# Altium project EDR_LIPO.PrjPcb
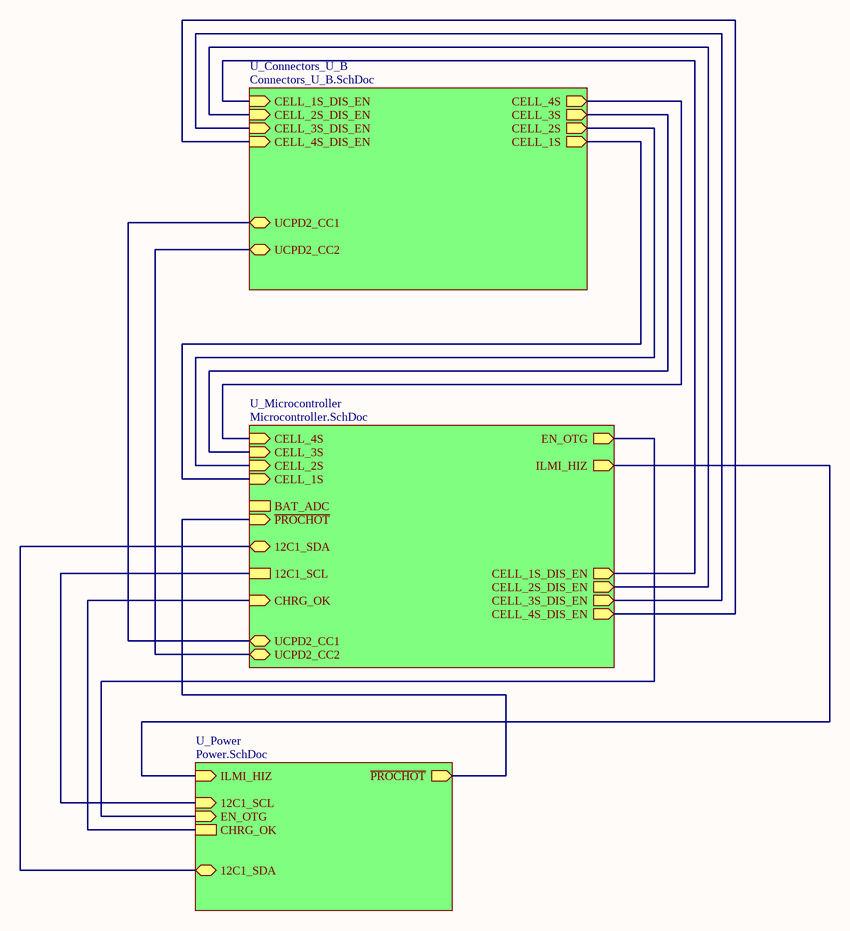
[diagram p0: Main.SchDoc]
4 sheets, 179 parts. Net scope: hierarchical (ports join the sheet entries above them; power ports are global).
Board file: Main_conection.PcbDoc
Sheets:
  Main.SchDoc
    U_Connectors_U_B = Connectors_U_B.SchDoc
    U_Microcontroller = Microcontroller.SchDoc
    U_Power = Power.SchDoc

## Sheet Main.SchDoc
size A; SheetNumber: 1; SheetTotal: 4

### Sub-sheets
U_Connectors_U_B = Connectors_U_B.SchDoc: CELL_4S (out), CELL_3S (out), CELL_2S (out), CELL_1S (out), CELL_1S_DIS_EN (in), CELL_2S_DIS_EN (in), CELL_3S_DIS_EN (in), CELL_4S_DIS_EN (in), UCPD2_CC1 (bidir), UCPD2_CC2 (bidir)
U_Microcontroller = Microcontroller.SchDoc: BAT_ADC, CELL_4S (in), CELL_3S (in), CELL_2S (in), CELL_1S (in), EN_OTG (out), ~{PROCHOT} (in), CELL_3S_DIS_EN (out), CELL_4S_DIS_EN (out), ILMI_HIZ (out), CELL_2S_DIS_EN (out), CELL_1S_DIS_EN (out), 12C1_SDA (bidir), 12C1_SCL, CHRG_OK (in), UCPD2_CC1 (bidir), UCPD2_CC2 (bidir)
U_Power = Power.SchDoc: ILMI_HIZ (in), ~{PROCHOT} (out), 12C1_SDA (bidir), 12C1_SCL (in), EN_OTG (in), CHRG_OK

### Nets
12C1_SCL: sheet U_Microcontroller/12C1_SCL, sheet U_Power/12C1_SCL
12C1_SDA: sheet U_Microcontroller/12C1_SDA, sheet U_Power/12C1_SDA
~{PROCHOT}: sheet U_Microcontroller/~{PROCHOT}, sheet U_Power/~{PROCHOT}
CELL_1S: sheet U_Connectors_U_B/CELL_1S, sheet U_Microcontroller/CELL_1S
CELL_1S_DIS_EN: sheet U_Connectors_U_B/CELL_1S_DIS_EN, sheet U_Microcontroller/CELL_1S_DIS_EN
CELL_2S: sheet U_Connectors_U_B/CELL_2S, sheet U_Microcontroller/CELL_2S
CELL_2S_DIS_EN: sheet U_Connectors_U_B/CELL_2S_DIS_EN, sheet U_Microcontroller/CELL_2S_DIS_EN
CELL_3S: sheet U_Connectors_U_B/CELL_3S, sheet U_Microcontroller/CELL_3S
CELL_3S_DIS_EN: sheet U_Connectors_U_B/CELL_3S_DIS_EN, sheet U_Microcontroller/CELL_3S_DIS_EN
CELL_4S: sheet U_Connectors_U_B/CELL_4S, sheet U_Microcontroller/CELL_4S
CELL_4S_DIS_EN: sheet U_Connectors_U_B/CELL_4S_DIS_EN, sheet U_Microcontroller/CELL_4S_DIS_EN
CHRG_OK: sheet U_Microcontroller/CHRG_OK, sheet U_Power/CHRG_OK
EN_OTG: sheet U_Microcontroller/EN_OTG, sheet U_Power/EN_OTG
ILIM_HIZ: sheet U_Microcontroller/ILMI_HIZ, sheet U_Power/ILMI_HIZ
UCPD2_CC1: sheet U_Connectors_U_B/UCPD2_CC1, sheet U_Microcontroller/UCPD2_CC1
UCPD2_CC2: sheet U_Connectors_U_B/UCPD2_CC2, sheet U_Microcontroller/UCPD2_CC2

## Sheet Connectors_U_B.SchDoc
size A4; SheetNumber: 2; SheetTotal: 4
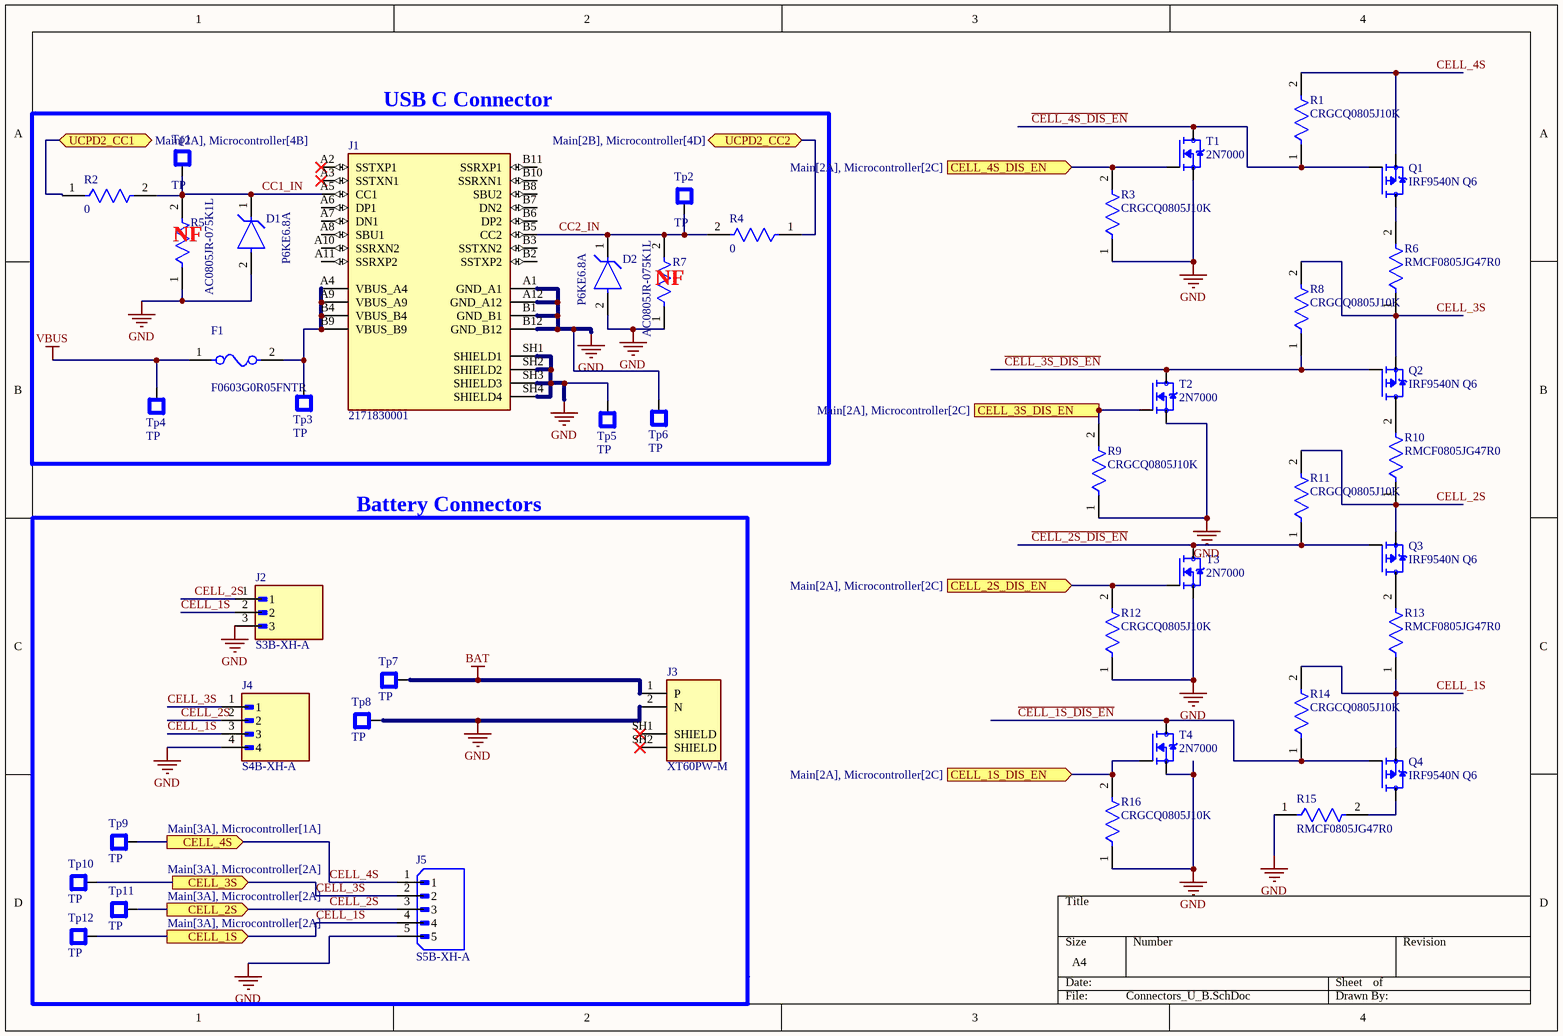
[diagram p1: Connectors_U_B.SchDoc]

### Parts
D1  P6KE6.8A  [FP-P6KE-MFG]
D2  P6KE6.8A  [FP-P6KE-MFG]
F1  F0603G0R05FNTR  [FP-F0603G-MFG]
J1  2171830001  [MOLEX_2171830001]
J2  S3B-XH-A  [JST_S3B-XH-A]
J3  XT60PW-M  [AMASS_XT60PW-M]
J4  S4B-XH-A  [JST_S4B-XH-A]
J5  S5B-XH-A  [JST_S5B-XH-A]
Q1  IRF9540N Q6  [TO254P1041X444X1930-3]
Q2  IRF9540N Q6  [TO254P1041X444X1930-3]
Q3  IRF9540N Q6  [TO254P1041X444X1930-3]
Q4  IRF9540N Q6  [TO254P1041X444X1930-3]
R1  CRGCQ0805J10K  [FP-CRGCQ0805-IPC_C]
R2  0  [FP-HCJ0805-MFG]
R3  CRGCQ0805J10K  [FP-CRGCQ0805-IPC_C]
R4  0  [FP-HCJ0805-MFG]
R5  AC0805JR-075K1L  [FP-AC0805-MFG]
R6  RMCF0805JG47R0  [FP-RMCF0805-MFG]
R7  AC0805JR-075K1L  [FP-AC0805-MFG]
R8  CRGCQ0805J10K  [FP-CRGCQ0805-IPC_C]
R9  CRGCQ0805J10K  [FP-CRGCQ0805-IPC_C]
R10  RMCF0805JG47R0  [FP-RMCF0805-MFG]
R11  CRGCQ0805J10K  [FP-CRGCQ0805-IPC_C]
R12  CRGCQ0805J10K  [FP-CRGCQ0805-IPC_C]
R13  RMCF0805JG47R0  [FP-RMCF0805-MFG]
R14  CRGCQ0805J10K  [FP-CRGCQ0805-IPC_C]
R15  RMCF0805JG47R0  [FP-RMCF0805-MFG]
R16  CRGCQ0805J10K  [FP-CRGCQ0805-IPC_C]
T1  2N7000  [TO92]
T2  2N7000  [TO92]
T3  2N7000  [TO92]
T4  2N7000  [TO92]
Tp1  TP  [Tp]
Tp2  TP  [Tp]
Tp3  TP  [Tp]
Tp4  TP  [Tp]
Tp5  TP  [Tp]
Tp6  TP  [Tp]
Tp7  TP  [Tp]
Tp8  TP  [Tp]
Tp9  TP  [Tp]
Tp10  TP  [Tp]
Tp11  TP  [Tp]
Tp12  TP  [Tp]

### Ports
CELL_1S (out, see Main[3A], Microcontroller[2A]), CELL_1S_DIS_EN (in, see Main[2A], Microcontroller[2C]), CELL_2S (out, see Main[3A], Microcontroller[2A]), CELL_2S_DIS_EN (in, see Main[2A], Microcontroller[2C]), CELL_3S (out, see Main[3A], Microcontroller[2A]), CELL_3S_DIS_EN (in, see Main[2A], Microcontroller[2C]), CELL_4S (out, see Main[3A], Microcontroller[1A]), CELL_4S_DIS_EN (in, see Main[2A], Microcontroller[2C]), UCPD2_CC1 (bidir, see Main[2A], Microcontroller[4B]), UCPD2_CC2 (bidir, see Main[2B], Microcontroller[4D])

### Nets
BAT: J3.1(P) Tp7.1
GND: D1.2(A) D2.2(A) J1.A1(GND_A1) J1.A12(GND_A12) J1.B1(GND_B1) J1.B12(GND_B12) J1.SH1(SHIELD1) J1.SH2(SHIELD2) J1.SH3(SHIELD3) J1.SH4(SHIELD4) J2.3 J3.2(N) J4.4 J5.5 R3.1 R5.1 R7.1 R9.1 R12.1 R15.1 R16.1 T1.1(S) T2.1(S) T3.1(S) T4.1(S) Tp5.1 Tp6.1 Tp8.1
VBUS: F1.1 Tp4.1
~{CELL_1S_DIS_EN}: Q4.1(G) R14.1 T4.3(D)
~{CELL_2S_DIS_EN}: Q3.1(G) R11.1 T3.3(D)
~{CELL_3S_DIS_EN}: Q2.1(G) R8.1 T2.3(D)
~{CELL_4S_DIS_EN}: Q1.1(G) R1.1 T1.3(D)
CC1_IN: D1.1(C) J1.A5(CC1) R2.2 R5.2 Tp1.1
CC2_IN: D2.1(C) J1.B5(CC2) R4.2 R7.2 Tp2.1
CELL_1S: J2.2 J4.3 J5.4 Q4.3(S) R13.1 R14.2 Tp12.1 ; port CELL_1S
CELL_1S_DIS_EN: R16.2 T4.2(G) ; port CELL_1S_DIS_EN
CELL_2S: J2.1 J4.2 J5.3 Q3.3(S) R10.1 R11.2 Tp11.1 ; port CELL_2S
CELL_2S_DIS_EN: R12.2 T3.2(G) ; port CELL_2S_DIS_EN
CELL_3S: J4.1 J5.2 Q2.3(S) R6.1 R8.2 Tp10.1 ; port CELL_3S
CELL_3S_DIS_EN: R9.2 T2.2(G) ; port CELL_3S_DIS_EN
CELL_4S: J5.1 Q1.3(S) R1.2 Tp9.1 ; port CELL_4S
CELL_4S_DIS_EN: R3.2 T1.2(G) ; port CELL_4S_DIS_EN
UCPD2_CC1: R2.1 ; port UCPD2_CC1
UCPD2_CC2: R4.1 ; port UCPD2_CC2
NetF1_2: F1.2 J1.A4(VBUS_A4) J1.A9(VBUS_A9) J1.B4(VBUS_B4) J1.B9(VBUS_B9) Tp3.1
NetQ1_2: Q1.2(D) R6.2
NetQ2_2: Q2.2(D) R10.2
NetQ3_2: Q3.2(D) R13.2
NetQ4_2: Q4.2(D) R15.2

Not connected (* = marked no-connect by the designer): J1 A2(SSTXP1)* A3(SSTXN1)* A6(DP1) A7(DN1) A8(SBU1) A10(SSRXN2) A11(SSRXP2) B2(SSTXP2) B3(SSTXN2) B6(DP2) B7(DN2) B8(SBU2) B10(SSRXN1) B11(SSRXP1); J3 SH1(SHIELD)* SH2(SHIELD)*

### Notes on the sheet
- USB C Connector
- (near R5) NF
- (near R7) NF
- Battery Connectors

### Library data of the parts
D1 D2 = CMP-08607-000072-1: TVS DIODE 5.8V 10.5V DO204AC; Manufacturer: Littelfuse Inc; Peak Pulse Power: 600W; Max Junction Temp: +175°C; Peak Pulse Current: 58.1A; Number Of Channels: 1; Direction: Unidirectional; Breakdown Voltage: 6.45V; Mouser Description: TVSS; Diode; For Data/Comm; Industrial Equip; 58.1A; Thru-Hole; Solder Term; Height: 3.6mm; RoHS: TRUE; Lead Free: Yes; Category: Diode; ComponentLink2Description: Datasheet; Manufacturer Part Number: P6KE6.8A; Package: P6KE; Temperature Range Low: -55°C; Device Class L3: unset; Digikey Description: TVS DIODE 5.8V 10.5V DO204AC; Temperature Range High: +175°C; Automotive: No; Clamping Voltage: 10.5V; Ipc Land Pattern Name: DIOPA1328W105L760D360; Octopart: https://octopart.com/p6ke6.8a-littelfuse-20808; ComponentLink2URL: https://www.littelfuse.com/~/media/electronics/datasheets/tvs_diodes/littelfuse_tvs_diode_p6ke_datasheet.pdf.pdf; Temperature: -55°C to +175°C; Device Class L2: TVS Diodes; Device Class L1: Circuit Protection; Reverse Standoff Voltage: 5.8V
F1 = CMP-04585-000004-1: FUSE BOARD MOUNT 50MA 32VDC 0603; Manufacturer: AVX Corporation; Voltage Rating: 32V; Fuse I2T: 0.000002A2Sec; Fuse Current: 0.125A; Fuse Voltage Drop: 250mV; Fuse Blow Speed: Fast; Value: 3.4Ω; ComponentLink2URL: http://datasheets.avx.com/AccuGuardLC_0603.pdf; Digikey Description: FUSE BOARD MOUNT 50MA 32VDC 0603; Lead Free: Yes; Temperature: -55°C to +125°C; Device Class L2: Fuses; Device Class L1: Circuit Protection; ComponentLink2Description: Datasheet; Category: Fuse; Package: F0603G; Height: 0.71mm; Mouser Description: Fuse Chip 0.05A 32V Fast 2-Pin Solder Pad Surface Mount T/R; Device Class L3: unset; Temperature Range High: +125°C; Temperature Range Low: -55°C; Octopart: https://octopart.com/f0603g0r05fntr-avx-21046321; Resistance: 3.4Ω; RoHS: TRUE; Manufacturer Part Number: F0603G0R05FNTR; Automotive: No
J1 = 2171830001: MF: {'manufacturer': u'Molex'}; Package: None; Price: None; Value: *; MP: 2171830001; Availability: Unavailable
J3 = XT60PW-M: Socket, DC supply, male, PIN: 2; MF: AMASS; SnapEDA_Link: https://www.snapeda.com/parts/XT60PW-M/AMASS/view-part/?ref=snap; Package: Package; Value: *; MP: XT60PW-M; Check_prices: https://www.snapeda.com/parts/XT60PW-M/AMASS/view-part/?ref=eda
J5 = S5B-XH-A: Connector Header Through Hole, Right Angle 5 position 0.098 (2.50mm); MF: JST Sales; SnapEDA_Link: https://www.snapeda.com/parts/S5B-XH-A/JST+Sales+America+Inc./view-part/?ref=snap; Package: None; Value: *; MP: S5B-XH-A; Check_prices: https://www.snapeda.com/parts/S5B-XH-A/JST+Sales+America+Inc./view-part/?ref=eda
Q1-Q4 = IRF9540N Q6: P-Channel 100 V 23A (Tc) 3.1W (Ta), 110W (Tc); MF: Infineon Technologies; Value: *; Purchase-URL: https://pricing.snapeda.com/search/part/IRF9540N/?ref=eda; Package: TO-220 Infineon; MP: IRF9540N; Check_prices: https://www.snapeda.com/parts/IRF9540N/Infineon+Technologies/view-part/?ref=eda; SnapEDA_Link: https://www.snapeda.com/parts/IRF9540N/Infineon+Technologies/view-part/?ref=snap; Price: None; Availability: In Stock
R1 R3 R8 R9 R11 R12 R14 R16 = CMP-03211-002989-1: CRGCQ 0805 10K 5%; Manufacturer: TE Connectivity; Voltage Rating: 150V; Temperature Coefficient: ±100ppm/°C; Resistance: 10KΩ; Value: 10KΩ; Power Rating: 0.125W; Tolerance: 0.05; Automotive Grade: Grade 914; Height: 0.65mm; Lead Free: Yes; Temperature Range High: +155°C; Composition: Thick Film; Temperature Range Low: -55°C; Ambient Temperature Range High: +70°C; Temperature: -55°C to +155°C; Package: CRGCQ0805; Device Class L2: Resistors; RoHS: TRUE; ComponentLink2URL: https://www.te.com/commerce/DocumentDelivery/DDEController?Action=showdoc&DocId=Data+Sheet%7F1773204-3%7F1%7Fpdf%7FEnglish%7FENG_DS_1773204-3_1.pdf%7F4-2176341-923; Manufacturer Part Number: CRGCQ0805J10K; Series: CRGCQ; Device Class L1: Passive Components; Ipc Land Pattern Name: RESC200125X55; ComponentLink2Description: Datasheet; Category: Res; Digikey Description: CRGCQ 0805 10K 5%; Mouser Description: Res Thick Film 0805 10K Ohm 5% 0.125W(1/8W) ±100ppm/C Pad SMD Automotive T/R; Automotive: Yes; Octopart: https://octopart.com/crgcq0805j10k-te+connectivity-91018201; Device Class L3: Chip SMD Resistors
R2 R4 = CMP-26527-000104-1: RES 0 OHM JUMPER 1/2W 0805; Resistance: 0mR; Radiation Hardening: No; Case Code (Imperial): 0805; Number of Terminations: 2; Lead Free: Lead Free; Max Operating Temperature: 155°C; Width: 0.049inch; Case Code (Metric): 2012; Height: 0.026inch; Mount: Surface Mount; Min Operating Temperature: -55°C; Packaging: Tape and Reel; Package Quantity: 1; Termination: Wraparound; Length: 0.079inch; RoHS Compliant: Yes; Case/Package: 0805
R5 R7 = CMP-2001-04477-2: RES SMD 5.1K OHM 5% 1/8W 0805; Manufacturer: Yageo; Automotive Grade: Grade 0; Value: 5.1KΩ; Voltage Rating: 150V; Tolerance: 0.05; Category: Res; RoHS: TRUE; Automotive: Yes; Device Class L1: Passive Components; Lead Free: Yes; Octopart: https://octopart.com/ac0805jr-075k1l-yageo-21711115; Series: AC; Temperature Range High: +155°C; ComponentLink2URL: http://www.yageo.com/documents/recent/PYu-AC_51_RoHS_L_6.pdf; Temperature Range Low: -55°C; ComponentLink2Description: Datasheet; Footprint Url: http://www.yageo.com/exep/pages/download/literatures/PYu-R_Mount_10.pdf; Mouser Description: Thick Film Resistors - SMD 5.1K ohm 5% 1/8W; Device Class L3: Chip SMD Resistors; Digikey Description: RES SMD 5.1K OHM 5% 1/8W 0805; Power Rating: 1/8W; Package: AC0805; Temperature: -55°C to +155°C; Device Class L2: Resistors; Resistance: 5.1KΩ; Height: 0.6mm; Manufacturer Part Number: AC0805JR-075K1L; Ipc Land Pattern Name: RESC200125X50; Composition: Thick Film
R6 R10 R13 R15 = CMP-26527-004456-1: 47Ω ±5% 0.125W 0805 Thick Film Chip Resistor AEC-Q200 compliant; Max Power Dissipation: 125mW; Resistance: 47R; Temperature Coefficient: 200ppm/°C; Packaging: Tape and Reel; Case Code (Metric): 2012; Mount: Surface Mount; Min Operating Temperature: -55°C; Package Quantity: 10000; Length: 0.079inch; Number of Terminations: 2; RoHS Compliant: Yes; Max Operating Temperature: 155°C; Case/Package: 0805; Height: 0.026inch; Radiation Hardening: No; Resistor Type: Thick Film; Contact Plating: Tin; Width: 0.049inch; Case Code (Imperial): 0805; Series: RMCF; Features: Automotive AEC-Q200; Tolerance: 5%
T1-T4 = 2N7000: N-Channel 60 V 200mA (Ta) 400mW (Ta) Through Hole TO-92-3; MF: onsemi; SnapEDA_Link: https://www.snapeda.com/parts/2N7000/Onsemi/view-part/?ref=snap; Package: E-PKG AXIAL-LEADED-2 ON Semiconductor; Value: *; MP: 2N7000; Check_prices: https://www.snapeda.com/parts/2N7000/Onsemi/view-part/?ref=eda
J2 = S3B-XH-A: Package: None; Price: None; Value: *; MP: S3B-XH-A; Availability: Unavailable
J4 = S4B-XH-A: Package: None; Price: None; Value: *; MP: S4B-XH-A; Availability: Unavailable

## Sheet Microcontroller.SchDoc
size A; SheetNumber: 4; SheetTotal: 4
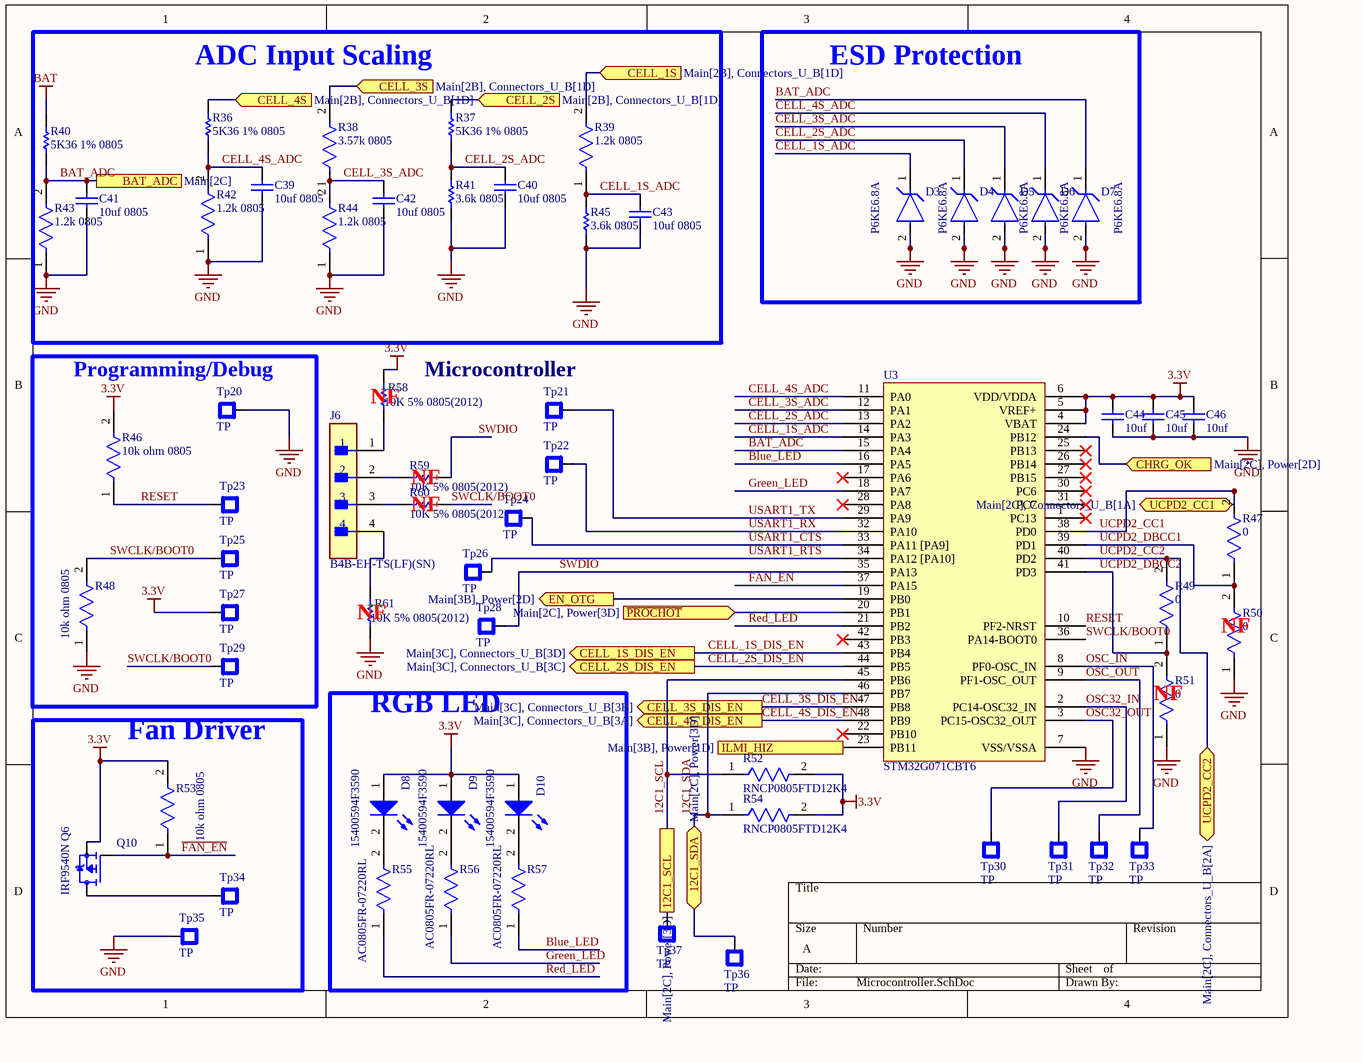
[diagram p2: Microcontroller.SchDoc]

### Parts
C39  10uf 0805  [CAPC2013X145X50NL20T20]
C40  10uf 0805  [CAPC2013X145X50NL20T20]
C41  10uf 0805  [CAPC2013X145X50NL20T20]
C42  10uf 0805  [CAPC2013X145X50NL20T20]
C43  10uf 0805  [CAPC2013X145X50NL20T20]
C44  10uf  [CAPC2013X145X50LL20T25]
C45  10uf  [CAPC2013X145X50LL20T25]
C46  10uf  [CAPC2013X145X50LL20T25]
D3  P6KE6.8A  [FP-P6KE-MFG]
D4  P6KE6.8A  [FP-P6KE-MFG]
D5  P6KE6.8A  [FP-P6KE-MFG]
D6  P6KE6.8A  [FP-P6KE-MFG]
D7  P6KE6.8A  [FP-P6KE-MFG]
D8  15400594F3590  [WL-TIRC_5mm]
D9  15400594F3590  [WL-TIRC_5mm]
D10  15400594F3590  [WL-TIRC_5mm]
J6  B4B-EH-TS(LF)(SN)  [FP-B4B-EH-TS_LF_SN-MFG]
Q10  IRF9540N Q6  [TO254P1041X444X1930-3]
R36  5K36 1% 0805  [RESC0805(2012)_M]
R37  5K36 1% 0805  [RESC0805(2012)_M]
R38  3.57k 0805  [FP-RT0805-MFG]
R39  1.2k 0805  [FP-RMCF0805-IPC_A]
R40  5K36 1% 0805  [RESC0805(2012)_M]
R41  3.6k 0805  [RESC0805(2012)_L]
R42  1.2k 0805  [FP-RMCF0805-IPC_A]
R43  1.2k 0805  [FP-RMCF0805-IPC_A]
R44  1.2k 0805  [FP-RMCF0805-IPC_A]
R45  3.6k 0805  [RESC0805(2012)_L]
R46  10k ohm 0805  [FP-MCU0805-IPC_C]
R47  0  [FP-HCJ0805-MFG]
R48  10k ohm 0805  [FP-MCU0805-IPC_C]
R49  0  [FP-HCJ0805-MFG]
R50  0  [FP-HCJ0805-MFG]
R51  0  [FP-HCJ0805-MFG]
R52  RNCP0805FTD12K4  [FP-RNCP0805-IPC_C]
R53  10k ohm 0805  [FP-MCU0805-IPC_C]
R54  RNCP0805FTD12K4  [FP-RNCP0805-IPC_C]
R55  AC0805FR-07220RL  [FP-AC0805-MFG]
R56  AC0805FR-07220RL  [FP-AC0805-MFG]
R57  AC0805FR-07220RL  [FP-AC0805-MFG]
R58  10K 5% 0805(2012)  [RESC0805(2012)_L]
R59  10K 5% 0805(2012)  [RESC0805(2012)_L]
R60  10K 5% 0805(2012)  [RESC0805(2012)_L]
R61  10K 5% 0805(2012)  [RESC0805(2012)_L]
Tp20  TP  [Tp]
Tp21  TP  [Tp]
Tp22  TP  [Tp]
Tp23  TP  [Tp]
Tp24  TP  [Tp]
Tp25  TP  [Tp]
Tp26  TP  [Tp]
Tp27  TP  [Tp]
Tp28  TP  [Tp]
Tp29  TP  [Tp]
Tp30  TP  [Tp]
Tp31  TP  [Tp]
Tp32  TP  [Tp]
Tp33  TP  [Tp]
Tp34  TP  [Tp]
Tp35  TP  [Tp]
Tp36  TP  [Tp]
Tp37  TP  [Tp]
U3  STM32G071CBT6  [QFP50P900X900X160-48N]

### Blocks framed on the sheet
ADC Input Scaling: C39-C43 R36-R45
ESD Protection: D3-D7
Programming/Debug: R46 R48 Tp20 Tp23 Tp25 Tp27 Tp29
Fan Driver: Q10 R53 Tp34 Tp35
RGB LED: D8-D10 R55-R57

### Ports
12C1_SCL (see Main[2C], Power[3D]), 12C1_SDA (bidir, see Main[2C], Power[3D]), BAT_ADC (see Main[2C]), CELL_1S (in, see Main[2B], Connectors_U_B[1D]), CELL_1S_DIS_EN (out, see Main[3C], Connectors_U_B[3D]), CELL_2S (in, see Main[2B], Connectors_U_B[1D]), CELL_2S_DIS_EN (out, see Main[3C], Connectors_U_B[3C]), CELL_3S (in, see Main[2B], Connectors_U_B[1D]), CELL_3S_DIS_EN (out, see Main[3C], Connectors_U_B[3B]), CELL_4S (in, see Main[2B], Connectors_U_B[1D]), CELL_4S_DIS_EN (out, see Main[3C], Connectors_U_B[3A]), CHRG_OK (in, see Main[2C], Power[2D]), EN_OTG (out, see Main[3B], Power[2D]), ILMI_HIZ (out, see Main[3B], Power[1D]), UCPD2_CC1 (bidir, see Main[2C], Connectors_U_B[1A]), UCPD2_CC2 (bidir, see Main[2C], Connectors_U_B[2A]), ~{PROCHOT} (in, see Main[2C], Power[3D])

### Nets
3.3V: C44.2 C45.2 C46.2 D8.1(A) D9.1(A) D10.1(A) Q10.3(S) R46.2 R52.2 R53.2 R54.2 R58.2 Tp27.1 U3.4(VBAT) U3.5(VREF+) U3.6(VDD/VDDA)
BAT: R40.2
GND: C39.1 C40.1 C41.1 C42.1 C43.1 C44.1 C45.1 C46.1 D3.2(A) D4.2(A) D5.2(A) D6.2(A) D7.2(A) R41.1 R42.1 R43.1 R44.1 R45.1 R48.1 R50.1 R51.1 R61.1 Tp20.1 Tp35.1 U3.7(VSS/VSSA)
12C1_SCL: R52.1 Tp37.1 U3.45(PB6) ; port 12C1_SCL
12C1_SDA: R54.1 Tp36.1 U3.46(PB7) ; port 12C1_SDA
~{PROCHOT}: U3.20(PB1) ; port ~{PROCHOT}
BAT_ADC: C41.2 D7.1(C) R40.1 R43.2 U3.15(PA4) ; port BAT_ADC
Blue_LED: R57.1 U3.16(PA5)
CELL_1S: R39.2 ; port CELL_1S
CELL_1S_ADC: C43.2 D3.1(C) R39.1 R45.2 U3.14(PA3)
CELL_1S_DIS_EN: U3.43(PB4) ; port CELL_1S_DIS_EN
CELL_2S: R37.2 ; port CELL_2S
CELL_2S_ADC: C40.2 D4.1(C) R37.1 R41.2 U3.13(PA2)
CELL_2S_DIS_EN: U3.44(PB5) ; port CELL_2S_DIS_EN
CELL_3S: R38.2 ; port CELL_3S
CELL_3S_ADC: C42.2 D5.1(C) R38.1 R44.2 U3.12(PA1)
CELL_3S_DIS_EN: U3.47(PB8) ; port CELL_3S_DIS_EN
CELL_4S: R36.2 ; port CELL_4S
CELL_4S_ADC: C39.2 D6.1(C) R36.1 R42.2 U3.11(PA0)
CELL_4S_DIS_EN: U3.48(PB9) ; port CELL_4S_DIS_EN
CHRG_OK: U3.24(PB12) ; port CHRG_OK
EN_OTG: U3.19(PB0) ; port EN_OTG
~{FAN_EN}: Q10.1(G) R53.1 U3.37(PA15)
Green_LED: R56.1 U3.18(PA7)
ILIM_HIZ: U3.23(PB11) ; port ILMI_HIZ
OSC32_IN: Tp31.1 U3.2(PC14-OSC32_IN)
OSC32_OUT: Tp30.1 U3.3(PC15-OSC32_OUT)
OSC_IN: Tp33.1 U3.8(PF0-OSC_IN)
OSC_OUT: Tp32.1 U3.9(PF1-OSC_OUT)
Red_LED: R55.1 U3.21(PB2)
RESET: R46.1 Tp23.1 U3.10(PF2-NRST)
SWCLK/BOOT0: R48.2 R60.2 Tp25.1 Tp29.1 U3.36(PA14-BOOT0)
SWDIO: R59.2 Tp28.1 U3.35(PA13)
UCPD2_CC1: R47.2 U3.38(PD0) ; port UCPD2_CC1
UCPD2_CC2: R49.2 U3.40(PD2) ; port UCPD2_CC2
UCPD2_DBCC1: R47.1 R50.2 U3.39(PD1)
UCPD2_DBCC2: R49.1 R51.2 U3.41(PD3)
USART1_CTS: Tp24.1 U3.33(PA11_[PA9])
USART1_RTS: Tp26.1 U3.34(PA12_[PA10])
USART1_RX: Tp22.1 U3.32(PA10)
USART1_TX: Tp21.1 U3.29(PA9)
NetD8_2: D8.2(K) R55.2
NetD9_2: D9.2(K) R56.2
NetD10_2: D10.2(K) R57.2
NetJ6_1: J6.1 R58.1
NetJ6_2: J6.2 R59.1
NetJ6_3: J6.3 R60.1
NetJ6_4: J6.4 R61.2
NetQ10_2: Q10.2(D) Tp34.1

Not connected (* = marked no-connect by the designer): U3 1(PC13)* 17(PA6)* 22(PB10)* 25(PB13)* 26(PB14)* 27(PB15)* 28(PA8)* 30(PC6)* 31(PC7)* 42(PB3)*

### Notes on the sheet
- (near R58) NF
- Microcontroller
- (near R59) NF
- (near R60) NF
- (near R61) NF
- (near R50) NF
- (near R51) NF

### Library data of the parts
C39-C43 = CMP-2007-01676-1: Part Number: VJ0805Y105KXQRW1BC; Manufacturer: Vitramon
C44-C46 = CMP-2007-01044-1: Manufacturer: Kemet; Part Number: C0805C106K8RACTU
D3-D7 = CMP-08607-000072-1: as D1 on sheet Connectors_U_B; Mouser Description: TVSS; Diode; For Data/Comm; Industrial Equip; 58.1A; Thru-Hole; Solder Term; Height: 3.6mm; RoHS: TRUE; Lead Free: Yes; Category: Diode; ComponentLink2Description: Datasheet; Manufacturer Part Number: P6KE6.8A; Package: P6KE; Temperature Range Low: -55°C; Device Class L3: unset; Digikey Description: TVS DIODE 5.8V 10.5V DO204AC; Temperature Range High: +175°C; Automotive: No; Clamping Voltage: 10.5V; Ipc Land Pattern Name: DIOPA1328W105L760D360; Octopart: https://octopart.com/p6ke6.8a-littelfuse-20808; ComponentLink2URL: https://www.littelfuse.com/~/media/electronics/datasheets/tvs_diodes/littelfuse_tvs_diode_p6ke_datasheet.pdf.pdf; Temperature: -55°C to +175°C; Device Class L2: TVS Diodes; Device Class L1: Circuit Protection; Reverse Standoff Voltage: 5.8V
D8-D10 = CMP-03913-110288041-2: Led, 5Mm, 940Nm, 30Mw/Sr, Th Rohs Compliant: Yes; Forward Voltage: 1.3V; Viewing Angle: 30°; Forward Current: 1A; Max Reverse Voltage (DC): 5V; RoHS: Compliant; Peak Wavelength: 940nm; Max Operating Temperature: 85°C; Min Operating Temperature: -40°C
J6 = CMP-17439-000699-1: CONN HEADER EH TOP 4POS 2.5MM; Number of Positions: 4; Case/Package: Radial; Pitch: 2.5mm; Lead Free: Lead Free; Termination: Crimp
Q10 = IRF9540N Q6: as Q1 on sheet Connectors_U_B; Value: *; Purchase-URL: https://pricing.snapeda.com/search/part/IRF9540N/?ref=eda; Package: TO-220 Infineon; MP: IRF9540N; Check_prices: https://www.snapeda.com/parts/IRF9540N/Infineon+Technologies/view-part/?ref=eda; SnapEDA_Link: https://www.snapeda.com/parts/IRF9540N/Infineon+Technologies/view-part/?ref=snap; Price: None; Availability: In Stock
R36 R37 R40 = CMP-1013-00593-1: 5K36 0.125W 1% 0805 (2012 Metric)  SMD; Value: 5360.00 Ohm; Case-Metric: 2012; Case-EIA: 0805; Power: 0.125 W; Tolerance: 1 %; Technology: SMT
R38 = CMP-03412-012413-1: RES 357K OHM 1/8W .1% SMD 0805; Manufacturer: Yageo; Manufacturer Part Number: RT0805BRD07357KL; Temperature Coefficient: 25 ppm/°C; Voltage Rating: 150V; Value: 357KΩ; Power Rating: 0.125W; Tolerance: 0.0025; Automotive: No; Octopart: https://octopart.com/rt0805brd07357kl-yageo-1483813; Package: RT0805; Ipc Land Pattern Name: RESC200125X50; ComponentLink2Description: Datasheet; Series: RT; ComponentLink2URL: http://www.yageo.com/documents/recent/PYu-RT_1-to-0.01_RoHS_L_9.pdf; Device Class L1: Passive Components; Height: 0.6mm; Digikey Description: RES 357K OHM 1/8W .1% SMD 0805; Category: Res; Lead Free: Yes; Temperature: -55°C to +155°C; Composition: Thin Film; Mouser Description: Thin Film Resistors - SMD 1/8W 357K ohm .1% 25ppm; Device Class L2: Resistors; RoHS: TRUE; Temperature Range High: +155°C; Device Class L3: Chip SMD Resistors; Resistance: 357KΩ; Footprint Url: http://www.yageo.com/exep/pages/download/literatures/PYu-R_Mount_10.pdf; Temperature Range Low: -55°C
R39 R42-R44 = CMP-26527-005543-1: 1.2kΩ ±5% 0.125W 0805 Thick Film Chip Resistor AEC-Q200 compliant; Resistance: 1.2kR; Temperature Coefficient: 200ppm/°C; Max Power Dissipation: 125mW; RoHS Compliant: Yes; Width: 0.049inch; Max Operating Temperature: 155°C; Features: Automotive AEC-Q200; Contact Plating: Tin; Series: RMCF; Height: 0.026inch; Radiation Hardening: No; Packaging: Tape and Reel; Number of Terminations: 2; Length: 0.079inch; Min Operating Temperature: -55°C; Resistor Type: Thick Film; Case/Package: 0805; Tolerance: 5%; Mount: Surface Mount
R41 R45 = CMP-1013-00087-1: 3K6 0.125W 5% 0805 (2012 Metric)  SMD; Case-Metric: 2012; Value: 3600.00 Ohm; Case-EIA: 0805; Technology: SMT; Tolerance: 5 %; Power: 0.125 W
R46 R48 R53 = CMP-02407-000241-1: RES 1.05K OHM 0.5% 1/5W 0805; Power Rating: 200mW; Tolerance: 0.1%; Voltage Rating: 150V; Resistance: 10kR; Height: 0.52mm; Min Operating Temperature: -55°C; Packaging: Tape and Reel; Case Code (Imperial): 0805; Case/Package: 0805; Case Code (Metric): 2012; Weight: 0.000162oz; Width: 1.25mm; Length: 2mm; Max Operating Temperature: 155°C; Composition: Thin Film
R47 R49-R51 = CMP-26527-000104-1: as R2 on sheet Connectors_U_B; Radiation Hardening: No; Case Code (Imperial): 0805; Number of Terminations: 2; Lead Free: Lead Free; Max Operating Temperature: 155°C; Width: 0.049inch; Case Code (Metric): 2012; Height: 0.026inch; Mount: Surface Mount; Min Operating Temperature: -55°C; Packaging: Tape and Reel; Package Quantity: 1; Termination: Wraparound; Length: 0.079inch; RoHS Compliant: Yes; Case/Package: 0805
R52 R54 = CMP-26527-001038-1: 12.4kΩ ±1% 0.25W 0805 High Power Anti-Sulfur Thin Film Chip Resistor; Temperature Coefficient: 100ppm/°C; Max Power Dissipation: 250mW; Resistance: 12.4kR; Height: 0.024inch; Resistor Type: Thin Film; Width: 0.049inch; Case/Package: 0805; Series: RNCP; Min Operating Temperature: -55°C; Case Code (Metric): 2012; Packaging: Tape and Reel; Case Code (Imperial): 0805; Tolerance: 1%; RoHS Compliant: Yes; Max Operating Temperature: 155°C; Number of Terminations: 2; Features: Moisture Resistant; Length: 0.079inch; Mount: Surface Mount
R55-R57 = CMP-2001-04488-2: RES SMD 220 OHM 1% 1/8W 0805; Manufacturer: Yageo; Value: 220Ω; Tolerance: 0.01; Voltage Rating: 150V; Automotive Grade: Grade 0; Automotive: Yes; Composition: Thick Film; Lead Free: Yes; Octopart: https://octopart.com/ac0805fr-07220rl-yageo-26041145; Series: AC; Device Class L1: Passive Components; Temperature: -55°C to +155°C; Device Class L3: Chip SMD Resistors; Package: AC0805; Digikey Description: RES SMD 220 OHM 1% 1/8W 0805; ComponentLink2URL: http://www.yageo.com/documents/recent/PYu-AC_51_RoHS_L_6.pdf; ComponentLink2Description: Datasheet; Resistance: 220Ω; Mouser Description: Thick Film Resistors - SMD 1/8W 220ohm 1% AEC-Q200; Ipc Land Pattern Name: RESC200125X50; Power Rating: 1/8W; Device Class L2: Resistors; Category: Res; Footprint Url: http://www.yageo.com/exep/pages/download/literatures/PYu-R_Mount_10.pdf; Manufacturer Part Number: AC0805FR-07220RL; Temperature Range Low: -55°C; Height: 0.6mm; Temperature Range High: +155°C; RoHS: TRUE
R58-R61 = CMP-1013-00098-1: 10K 0.125W 5% 0805 (2012 Metric)  SMD; Case-EIA: 0805; Case-Metric: 2012; Value: 10000.00 Ohm; Power: 0.125 W; Technology: SMT; Tolerance: 5 %
U3 = STM32G071CBT6: MCU 32-bit ARM Cortex M0+ RISC 128KB Flash 1.8V/2.5V/3.3V 48-Pin LQFP Tray; Manufacturer: STMicroelectronics; ADC Channels (Resolution): 14-Ch 12-Bit; Core Architecture: ARM Cortex-M0+; DAC Channels (Resolution): 2-Ch 12-Bit; Data Bus Width: 32b; EEPROM Memory Size: 0B; Frequency: 64MHz; Interface: I2S; Clock Frequency: 48MHz; Max Junction Temperature (Tj): 105°C; Max Supply Current: 7mA; Max Supply Voltage: 3.6V; Min Supply Voltage: 1.7V; Number of A/D Converters: 1; Number of ADC Channels: 17; Number of Channels: 14; Number of D/A Converters: 2; Number of I/Os: 5; Number of Interrupts: 44; Number of Timers/Counters: 12; Number of UART Channels: 0; Number of USART Channels: 4; Operating Supply Voltage: 1.8V; Peripherals: POR, PWM, WDT; RAM Size: 36kB; Supplier: Avnet; Supplier Part Number: 84AC2899; Manufacturer Part Number: STM32G071CBT6; RoHS: Compliant; Category: Microcontrollers; Stock: 1757; Pricing: 1=3.97, 10=3.29, 25=3.08, 50=2.97, 100=2.86, 250=2.76, 500=2.69 (USD); Ambient Temperature Range High: 85°C; Case/Package: LFQFP; China RoHS: Compliant; Country of Origin: Mainland China; Export Control Classification Number (ECCN) Code: 3A991.A.2; Flash Memory Size: 128kB; Height: 1.6mm; Height - Seated (Max): 1.6mm; Harmonized Tariff Schedule (HTS) Code: 8542.31.00.25; Introduction Date: 2019-03-07; Length: 7mm; Lifecycle Status: Production; Max Operating Temperature: 85°C; Memory Size: 128kB; Memory Format: FLASH; Min Operating Temperature: -40°C; Number of I2C Channels: 2; Number of SPI Channels: 2; Number of Terminals: 48; Number of USB Channels: 2; REACH SVHC: Yes; Schedule B: 8542310000, 8542310000|8542310000, 8542310000|8542310000|8542310000|8542310000|8542310000; Terminal Pitch: 500µm; Width: 7mm; ComponentLink1URL: https://datasheet.octopart.com:443/STM32G071CBT6-STMicroelectronics-datasheet-159144893.pdf?src-supplier=IHS; ComponentLink1Description: https://datasheet.octopart.com:443/STM32G071CBT6-STMicroelectronics-datasheet-159144893.pdf?src-supplier=IHS; ComponentLink2URL: https://datasheet.octopart.com:443/STM32G071CBT6-STMicroelectronics-datasheet-132344621.pdf?src-supplier=ODG+(Origin+Data+Global); ComponentLink2Description: https://datasheet.octopart.com:443/STM32G071CBT6-STMicroelectronics-datasheet-132344621.pdf?src-supplier=ODG+(Origin+Data+Global); ComponentLink3URL: https://datasheet.octopart.com:443/STM32G071CBT6-STMicroelectronics-datasheet-130125765.pdf?src-supplier=element14+APAC; ComponentLink3Description: https://datasheet.octopart.com:443/STM32G071CBT6-STMicroelectronics-datasheet-130125765.pdf?src-supplier=element14+APAC

## Sheet Power.SchDoc
size A3; SheetNumber: 3; SheetTotal: 4
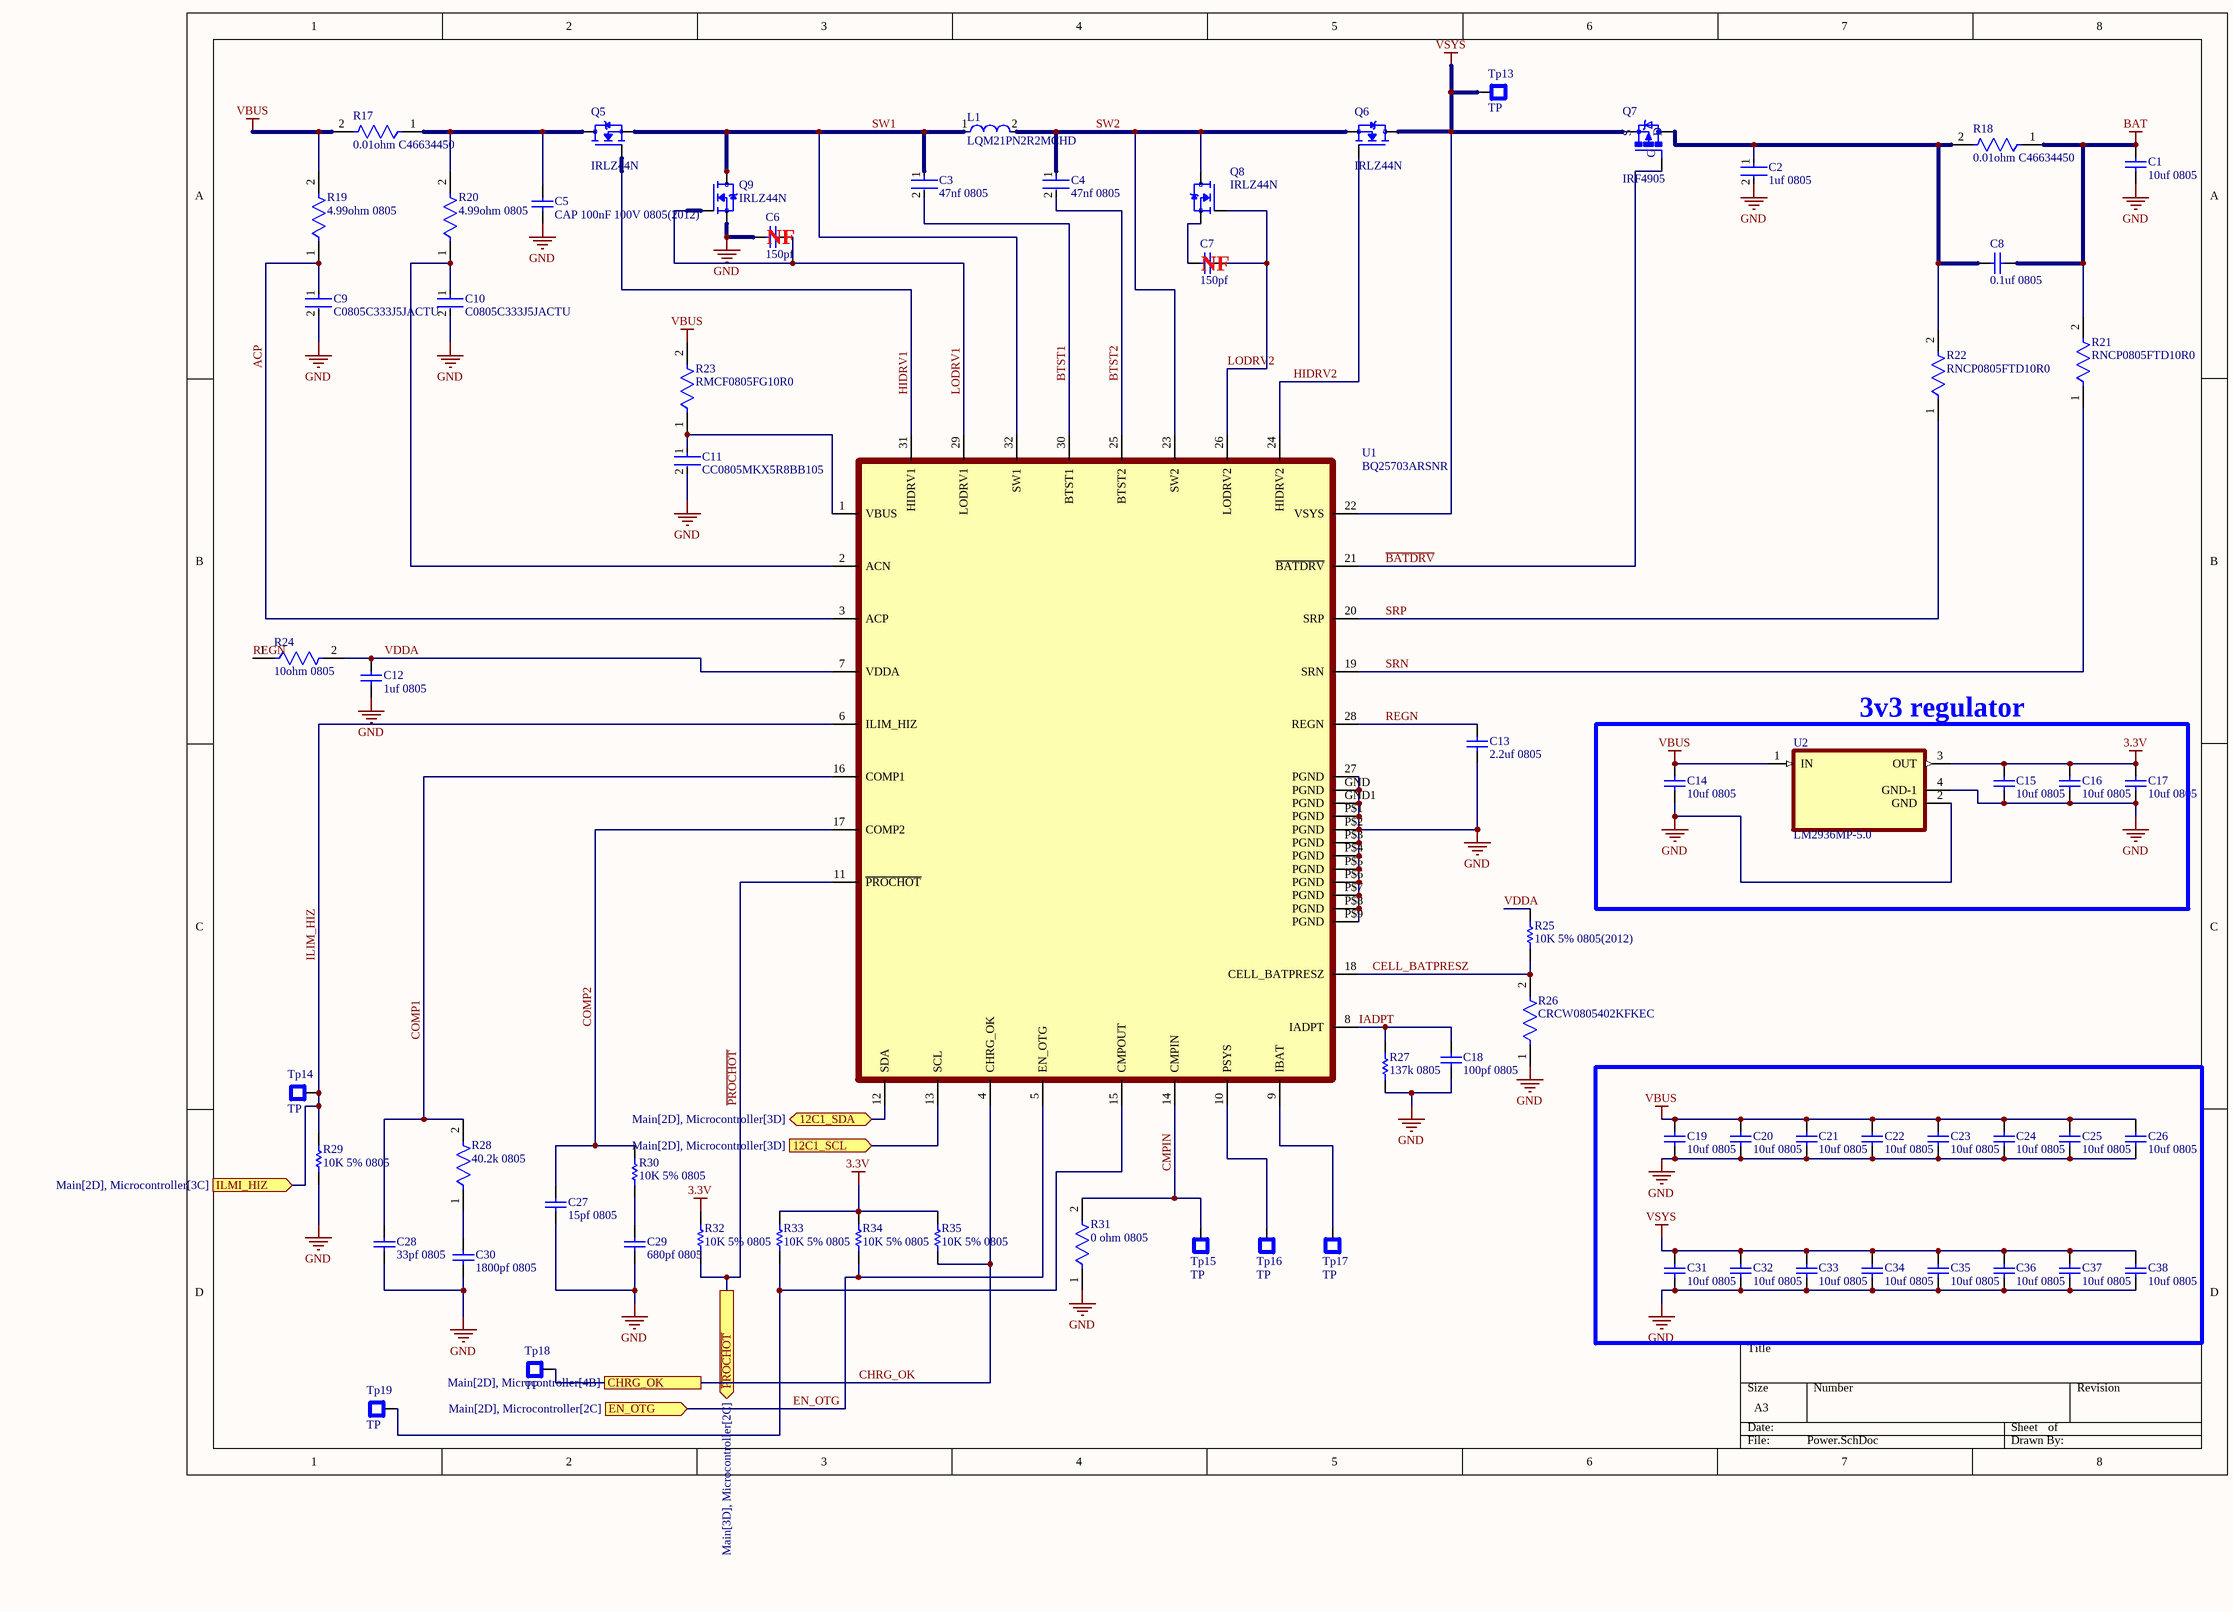
[diagram p3: Power.SchDoc]

### Parts
C1  10uf 0805  [CAPC2013X140X50ML20T25]
C2  1uf 0805  [FP-0805-L_2_01_0_2-W_1_25-MFG]
C3  47nf 0805  [FP-C0805C-DN-MFG]
C4  47nf 0805  [FP-C0805C-DN-MFG]
C5  CAP 100nF 100V 0805(2012)  [CAPC0805(2012)145_M]
C6  150pf  [CAPC2013X145X48NL20T23]
C7  150pf  [CAPC2013X145X48NL20T23]
C8  0.1uf 0805  [CAPC2013X140X50ML20T25]
C9  C0805C333J5JACTU  [FP-C0805C-DN-MFG]
C10  C0805C333J5JACTU  [FP-C0805C-DN-MFG]
C11  CC0805MKX5R8BB105  [FP-CC0805-0_85-MFG]
C12  1uf 0805  [CAPC2013X145X50NL20T20]
C13  2.2uf 0805  [CAPC2013X100X50ML20T25]
C14  10uf 0805  [CAPC2013X140X50ML20T25]
C15  10uf 0805  [CAPC2013X140X50ML20T25]
C16  10uf 0805  [CAPC2013X140X50ML20T25]
C17  10uf 0805  [CAPC2013X140X50ML20T25]
C18  100pf 0805  [CAPC2013X127X50NL20T25]
C19  10uf 0805  [CAPC2013X140X50ML20T25]
C20  10uf 0805  [CAPC2013X140X50ML20T25]
C21  10uf 0805  [CAPC2013X140X50ML20T25]
C22  10uf 0805  [CAPC2013X140X50ML20T25]
C23  10uf 0805  [CAPC2013X140X50ML20T25]
C24  10uf 0805  [CAPC2013X140X50ML20T25]
C25  10uf 0805  [CAPC2013X140X50ML20T25]
C26  10uf 0805  [CAPC2013X140X50ML20T25]
C27  15pf 0805  [CAPC2013X94X50LL20T25]
C28  33pf 0805  [CAPC2013X145X48LL20T23]
C29  680pf 0805  [CAPC0805(2012)145_L]
C30  1800pf 0805  [CAPC2013X145X48ML20T23]
C31  10uf 0805  [CAPC2013X140X50ML20T25]
C32  10uf 0805  [CAPC2013X140X50ML20T25]
C33  10uf 0805  [CAPC2013X140X50ML20T25]
C34  10uf 0805  [CAPC2013X140X50ML20T25]
C35  10uf 0805  [CAPC2013X140X50ML20T25]
C36  10uf 0805  [CAPC2013X140X50ML20T25]
C37  10uf 0805  [CAPC2013X140X50ML20T25]
C38  10uf 0805  [CAPC2013X140X50ML20T25]
L1  LQM21PN2R2MCHD  [FP-LQM21PN_CH-IPC_C]
Q5  IRLZ44N  [TO254P1054X469X1930-3]
Q6  IRLZ44N  [TO254P1054X469X1930-3]
Q7  IRF4905  [TO220BH]
Q8  IRLZ44N  [TO254P1054X469X1930-3]
Q9  IRLZ44N  [TO254P1054X469X1930-3]
R17  0.01ohm C46634450  [FP-CRCW0805-HPe3-MFG]
R18  0.01ohm C46634450  [FP-CRCW0805-HPe3-MFG]
R19  4.99ohm 0805  [FP-CRCW0805-HPe3-MFG]
R20  4.99ohm 0805  [FP-CRCW0805-HPe3-MFG]
R21  RNCP0805FTD10R0  [FP-RNCP0805-IPC_C]
R22  RNCP0805FTD10R0  [FP-RNCP0805-IPC_C]
R23  RMCF0805FG10R0  [FP-RMCF0805-IPC_B]
R24  10ohm 0805  [FP-RMCF0805-IPC_B]
R25  10K 5% 0805(2012)  [RESC0805(2012)_L]
R26  CRCW0805402KFKEC  [FP-CRCW0805-e3-IPC_B]
R27  137k 0805  [RESC2013X60X35ML10T20]
R28  40.2k 0805  [FP-ESR10-MFG]
R29  10K 5% 0805  [RESC0805(2012)_L]
R30  10K 5% 0805  [RESC0805(2012)_L]
R31  0 ohm 0805  [FP-HCJ0805-MFG]
R32  10K 5% 0805  [RESC0805(2012)_L]
R33  10K 5% 0805  [RESC0805(2012)_L]
R34  10K 5% 0805  [RESC0805(2012)_L]
R35  10K 5% 0805  [RESC0805(2012)_L]
Tp13  TP  [Tp]
Tp14  TP  [Tp]
Tp15  TP  [Tp]
Tp16  TP  [Tp]
Tp17  TP  [Tp]
Tp18  TP  [Tp]
Tp19  TP  [Tp]
U1  BQ25703ARSNR  [BQ25703A_QFN-32]
U2  LM2936MP-5.0  [SOT230P700X180-4N]

### Blocks framed on the sheet
3v3 regulator: C14-C17 U2

### Ports
12C1_SCL (in, see Main[2D], Microcontroller[3D]), 12C1_SDA (bidir, see Main[2D], Microcontroller[3D]), CHRG_OK (see Main[2D], Microcontroller[4B]), EN_OTG (in, see Main[2D], Microcontroller[2C]), ILMI_HIZ (in, see Main[2D], Microcontroller[3C]), ~{PROCHOT} (out, see Main[3D], Microcontroller[2C])

### Nets
3.3V: C15.2 C16.2 C17.2 R32.2 R33.2 R34.2 R35.2 U2.3(OUT)
BAT: C1.2 C8.1 R18.1 R21.2
GND: C1.1 C2.2 C5.1 C6.1 C9.2 C10.2 C11.2 C12.1 C13.1 C14.1 C15.1 C16.1 C17.1 C18.1 C19.1 C20.1 C21.1 C22.1 C23.1 C24.1 C25.1 C26.1 C27.1 C28.1 C29.1 C30.1 C31.1 C32.1 C33.1 C34.1 C35.1 C36.1 C37.1 C38.1 Q9.3(S) R26.1 R27.1 R29.1 R31.1 U1.27(PGND) U1.GND(PGND) U1.GND1(PGND) U1.P$1(PGND) U1.P$2(PGND) U1.P$3(PGND) U1.P$4(PGND) U1.P$5(PGND) U1.P$6(PGND) U1.P$7(PGND) U1.P$8(PGND) U1.P$9(PGND) U2.2(GND) U2.4(GND-1)
VBUS: C14.2 C19.2 C20.2 C21.2 C22.2 C23.2 C24.2 C25.2 C26.2 R17.2 R19.2 R23.2 U2.1(IN)
VSYS: C31.2 C32.2 C33.2 C34.2 C35.2 C36.2 C37.2 C38.2 Q6.2(D) Q7.S Tp13.1 U1.22(VSYS)
12C1_SCL: U1.13(SCL) ; port 12C1_SCL
12C1_SDA: U1.12(SDA) ; port 12C1_SDA
~{BATDRV}: Q7.G U1.21(~{BATDRV})
~{PROCHOT}: R32.1 U1.11(~{PROCHOT}) ; port ~{PROCHOT}
ACP: C9.1 R19.1 U1.3(ACP)
BTST1: C3.2 U1.30(BTST1)
BTST2: C4.2 U1.25(BTST2)
CELL_BATPRESZ: R25.1 R26.2 U1.18(CELL_BATPRESZ)
CHRG_OK: R35.1 Tp18.1 U1.4(CHRG_OK) ; port CHRG_OK
CMPIN: R31.2 Tp15.1 U1.14(CMPIN)
COMP1: C28.2 R28.2 U1.16(COMP1)
COMP2: C27.2 R30.2 U1.17(COMP2)
EN_OTG: R34.1 U1.5(EN_OTG) ; port EN_OTG
HIDRV1: Q5.1(G) U1.31(HIDRV1)
HIDRV2: Q6.1(G) U1.24(HIDRV2)
IADPT: C18.2 R27.2 U1.8(IADPT)
ILIM_HIZ: R29.2 Tp14.1 U1.6(ILIM_HIZ) ; port ILMI_HIZ
LODRV1: C6.2 Q9.1(G) U1.29(LODRV1)
LODRV2: C7.1 Q8.1(G) U1.26(LODRV2)
REGN: C13.2 R24.1 U1.28(REGN)
SRN: R21.1 U1.19(SRN)
SRP: R22.1 U1.20(SRP)
SW1: C3.1 L1.1 Q5.3(S) Q9.2(D) U1.32(SW1)
SW2: C4.1 L1.2 Q6.3(S) Q8.2(D) U1.23(SW2)
VDDA: C12.2 R24.2 R25.2 U1.7(VDDA)
NetC2_1: C2.1 C8.2 Q7.D R18.2 R22.2
NetC5_2: C5.2 Q5.2(D) R17.1 R20.2
NetC7_2: C7.2 Q8.3(S)
NetC10_1: C10.1 R20.1 U1.2(ACN)
NetC11_1: C11.1 R23.1 U1.1(VBUS)
NetC29_2: C29.2 R30.1
NetC30_2: C30.2 R28.1
NetR33_1: R33.1 Tp19.1 U1.15(CMPOUT)
NetTp16_1: Tp16.1 U1.10(PSYS)
NetTp17_1: Tp17.1 U1.9(IBAT)

### Notes on the sheet
- (near C6) NF
- (near C7) NF

### Library data of the parts
C1 C14-C17 C19-C26 C31-C38 = CMP-2007-04702-1: Manufacturer: AVX Interconnect / Elco; Part Number: 0805ZC106KAT2A
C2 = CMP-07738-122049624-1: 08051C105K4T2A Cap Ceramic 1uF 100V X7R 10% Pad SMD 0805 125C Automotive T/R; Capacitance: 1µF; Tolerance: 10%; Dielectric: X7R; Case/Package: 0805; Material: Ceramic; Height: 1.4mm; Voltage Rating (DC): 100V; Voltage Rating: 100V; Schedule B: 8532240020; NexarPartId: 122049624; RoHS: Compliant; Lifecycle Status: Production; Min Operating Temperature: -55°C; Max Operating Temperature: 125°C
C3 C4 = CMP-2007-00394-2: CAP CER 0.047UF 50V X7R 0805; Manufacturer: KEMET; Manufacturer Part Number: C0805C473K5RACAUTO; Value: 47,000 pF; Tolerance: 0.1; Temperature Coefficient: 30ppm/°C; Material: Ceramic; Temperature: -55°C to +125°C; ComponentLink2Description: Datasheet; Ipc Land Pattern Name: CAPC200125X78; Automotive: No; Voltage Rating: 50 V; Package: C0805C-DN; Category: Cap; Temperature Range High: +125°C; Device Class L2: Capacitors; Lead Free: Yes; Height: 0.88mm; Temperature Range Low: -55°C; Digikey Description: CAP CER 0.047UF 50V X7R 0805; ComponentLink2URL: https://content.kemet.com/datasheets/KEM_C1003_C0G_SMD.pdf; Device Class L1: Passive Components; Octopart: https://octopart.com/c0805c473k5racauto-kemet-12580596; Device Class L3: Ceramic Capacitors; RoHS: TRUE; Temperature Characteristic: X7R; Mouser Description: Multilayer Ceramic Capacitors MLCC - SMD/SMT 0.047uF 50volts 10% X7R AUTO; Capacitance: 47,000 pF
C5 = CMP-1036-04429-1: CAP 100nF 100V ±10% 0805 (2012 Metric) Thickness 1.45mm SMD; Tolerance: Â±10%; Case-Metric: 2012; Case-EIA: 0805; Rated Voltage: 100 V; Max Thickness: 1.45 mm; Technology: SMT; Value: 100nF
C6 C7 = CMP-2007-01759-1: Part Number: VJ0805A151JXAMC; Manufacturer: Vitramon
C8 = CMP-2007-04651-1: Part Number: 0805DD104KAT2A; Manufacturer: AVX Interconnect / Elco
C9 C10 = CMP-03020-013264-1: CAP CER 0.033UF 50V U2J 0805; Manufacturer: KEMET; Material: Ceramic; Value: 33,000 pF; Temperature Coefficient: 30ppm/°C; Tolerance: 0.05; Temperature Range Low: -55°C; Automotive: No; Device Class L3: Ceramic Capacitors; Device Class L2: Capacitors; RoHS: TRUE; Octopart: https://octopart.com/c0805c333j5jactu-kemet-74774612; Device Class L1: Passive Components; Manufacturer Part Number: C0805C333J5JACTU; ComponentLink2URL: https://content.kemet.com/datasheets/KEM_C1003_C0G_SMD.pdf; Temperature Characteristic: U2J; Ipc Land Pattern Name: CAPC200125X78; Height: 0.88mm; Category: Cap; ComponentLink2Description: Datasheet; Temperature: -55°C to +125°C; Capacitance: 33,000 pF; Package: C0805C-DN; Temperature Range High: +125°C; Voltage Rating: 50 V; Lead Free: Yes; Digikey Description: CAP CER 0.033UF 50V U2J 0805
C11 = CMP-03422-000762-1: CAP CER 1UF 25V X5R 0805; Manufacturer: Yageo; Material: Ceramic; Tolerance: 0.2; Package: CC0805-0.85; Value: 1 uF; Digikey Description: CAP CER 1UF 25V X5R 0805; ComponentLink2URL: http://www.yageo.com/documents/recent/UPY-GPHC_Y5V_6.3V-to-50V_8.pdf; Temperature: -30°C to +85°C; Device Class L1: Passive Components; Lead Free: Yes; Automotive: No; Ipc Land Pattern Name: CAPC200125X85; Footprint Url: http://www.yageo.com/exep/pages/download/literatures/UPY-C_GEN_24.pdf; Device Class L3: Ceramic Capacitors; RoHS: TRUE; Temperature Range High: +85°C; Capacitance: 1 uF; Height: 0.95mm; Mouser Description: Cap Cer 1uf 25v X5r 0805; Temperature Range Low: -30°C; Octopart: https://octopart.com/cc0805mkx5r8bb105-yageo-81932645; Voltage Rating: 25 V; ComponentLink2Description: Datasheet; Device Class L2: Capacitors; Temperature Characteristic: X5R; Manufacturer Part Number: CC0805MKX5R8BB105; Category: Cap
C12 = CMP-2007-01676-1: as C39 on sheet Microcontroller
C13 = CMP-2007-03688-1: Part Number: C0805C225M4PACTU; Manufacturer: Kemet
C18 = CMP-2007-04832-1: Part Number: 08052C101KAT2A; Manufacturer: AVX Interconnect / Elco
C27 = CMP-2007-04132-1: Part Number: 08051A150KAT2A; Manufacturer: AVX Interconnect / Elco
C28 = CMP-2007-01784-1: Part Number: VJ0805A330JXBAC; Manufacturer: Vitramon
C29 = CMP-1036-02840-1: CAP 680pF 100V ±10% 0805 (2012 Metric) Thickness 1.45mm SMD; Tolerance: Â±10%; Case-Metric: 2012; Case-EIA: 0805; Max Thickness: 1.45 mm; Technology: SMT; Value: 680pF; Rated Voltage: 100 V
C30 = CMP-2007-01890-1: Part Number: VJ0805A182FXAMT; Manufacturer: Vitramon
L1 = CMP-06042-016495-1: Multilayer Type Inductor for Power Lines, 2012, 2.2μH, 20%, 0.25Ω, 1.3A; RoHS Compliant: Yes
Q5 Q6 Q8 Q9 = IRLZ44N: N-Channel 55 V 47A (Tc) 3.8W (Ta), 110W (Tc) Surface Mount D2PAK; MF: Infineon / IR; Package: TO-220-3 Infineon / IR; Availability: Not in stock; Value: *; MP: IRLZ44N; Check_prices: https://www.snapeda.com/parts/IRLZ44N/Infineon/view-part/?ref=eda; Price: None; SnapEDA_Link: https://www.snapeda.com/parts/IRLZ44N/Infineon/view-part/?ref=snap
Q7 = IRF4905: P-Channel 55 V 74A (Tc) 200W (Tc) Through Hole TO-220AB; MF: Infineon / IR; SnapEDA_Link: https://www.snapeda.com/parts/IRF4905/Infineon/view-part/?ref=snap; Package: TO-263-3 Infineon / IR; Value: *; MP: IRF4905; Check_prices: https://www.snapeda.com/parts/IRF4905/Infineon/view-part/?ref=eda
R17-R20 = CMP-02407-002418-1: RES Thick Film, 4.99Ω, 0.5%, 0.5W, 100ppm/°C, 0805
R21 R22 = CMP-26527-001729-1: 10Ω ±1% 0.25W 0805 High Power Anti-Sulfur Thin Film Chip Resistor; Temperature Coefficient: 100ppm/°C; Max Power Dissipation: 250mW; Resistance: 10R; Length: 0.079inch; Tolerance: 1%; Series: RNCP; Case Code (Metric): 2012; Packaging: Tape and Reel; Resistor Type: Thin Film; Mount: Surface Mount; Min Operating Temperature: -55°C; Case Code (Imperial): 0805; Height: 0.024inch; Features: Moisture Resistant; RoHS Compliant: Yes; Width: 0.049inch; Max Operating Temperature: 155°C; Case/Package: 0805; Number of Terminations: 2
R23 R24 = CMP-26527-004108-1: 10Ω ±1% 0.125W 0805 Thick Film Chip Resistor AEC-Q200 compliant; Max Power Dissipation: 125mW; Resistance: 10R; Temperature Coefficient: 100ppm/°C; Series: RMCF; Resistor Type: Thick Film; Width: 0.049inch; Contact Plating: Tin; Number of Terminations: 2; Radiation Hardening: No; Max Operating Temperature: 155°C; Length: 0.079inch; RoHS Compliant: Yes; Mount: Surface Mount; Tolerance: 1%; Case/Package: 0805; Packaging: Tape and Reel; Min Operating Temperature: -55°C; Height: 0.026inch; Features: Automotive AEC-Q200
R25 R29 R30 R32-R35 = CMP-1013-00098-1: as R58 on sheet Microcontroller; Power: 0.125 W; Technology: SMT; Tolerance: 5 %
R26 = CMP-02407-010674-1: RES Thick Film, 402kΩ, 1%, 0.125W, 100ppm/°C, 0805; Resistance: 402kR; Max Power Dissipation: 125mW; Temperature Coefficient: 100ppm/°C; Composition: Thick Film; Height: 0.02inch; Length: 0.079inch; Package Quantity: 20000; Tolerance: 1%; Max Operating Temperature: 155°C; Lead Free: Lead Free; Min Operating Temperature: -55°C; Number of Terminations: 2; Case/Package: 0805; Packaging: Tape and Reel; Width: 0.049inch; Features: Automotive AEC-Q200
R27 = CMP-2001-00916-1: Manufacturer: Yageo; Part Number: RC0805FR-07137KL
R28 = CMP-08839-028060-1: 40.2kΩ ±1% 0.4W 0805 Anti-Surge Chip Resistor AEC-Q200; Max Power Dissipation: 400mW; Resistance: 40.2kR; Temperature Coefficient: 100ppm/°C; Length: 0.079inch; Width: 0.049inch; Package Quantity: 5000; Min Operating Temperature: -55°C; Case/Package: 0805; Features: Automotive AEC-Q200; Series: ESR10; Height: 0.026inch; Packaging: Tape and Reel; Max Operating Temperature: 155°C; Tolerance: 1%; RoHS Compliant: Yes; Number of Terminations: 2; Resistor Type: Thick Film
R31 = CMP-26527-000104-1: as R2 on sheet Connectors_U_B; Radiation Hardening: No; Case Code (Imperial): 0805; Number of Terminations: 2; Lead Free: Lead Free; Max Operating Temperature: 155°C; Width: 0.049inch; Case Code (Metric): 2012; Height: 0.026inch; Mount: Surface Mount; Min Operating Temperature: -55°C; Packaging: Tape and Reel; Package Quantity: 1; Termination: Wraparound; Length: 0.079inch; RoHS Compliant: Yes; Case/Package: 0805
U1 = BQ25703ARSNR: MCU 32-bit ARM Cortex M0+ RISC 128KB Flash 1.8V/2.5V/3.3V 48-Pin LQFP Tray; Manufacturer: STMicroelectronics; Manufacturer Part Number: STM32G071CBT6; MF: Texas Instruments; ADC Channels (Resolution): 14-Ch 12-Bit; Core Architecture: ARM Cortex-M0+; DAC Channels (Resolution): 2-Ch 12-Bit; Data Bus Width: 32b; EEPROM Memory Size: 0B; Frequency: 64MHz; Interface: I2S; Clock Frequency: 48MHz; Max Junction Temperature (Tj): 105°C; Max Supply Current: 7mA; Max Supply Voltage: 3.6V; Min Supply Voltage: 1.7V; Number of A/D Converters: 1; Number of ADC Channels: 17; Number of Channels: 14; Number of D/A Converters: 2; Number of I/Os: 5; Number of Interrupts: 44; Number of Timers/Counters: 12; Number of UART Channels: 0; Number of USART Channels: 4; Operating Supply Voltage: 1.8V; Peripherals: POR, PWM, WDT; RAM Size: 36kB; SnapEDA_Link: https://www.snapeda.com/parts/BQ25703ARSNR/Texas+Instruments/view-part/?ref=snap; Package: WQFN-32 Texas Instruments; Value: *; MP: BQ25703ARSNR; Check_prices: https://www.snapeda.com/parts/BQ25703ARSNR/Texas+Instruments/view-part/?ref=eda; Supplier: Avnet; Supplier Part Number: 84AC2899; RoHS: Compliant; Category: Microcontrollers; Stock: 1757; Pricing: 1=3.97, 10=3.29, 25=3.08, 50=2.97, 100=2.86, 250=2.76, 500=2.69 (USD); Ambient Temperature Range High: 85°C; Case/Package: LFQFP; China RoHS: Compliant; Country of Origin: Mainland China; Export Control Classification Number (ECCN) Code: 3A991.A.2; Flash Memory Size: 128kB; Height: 1.6mm; Height - Seated (Max): 1.6mm; Harmonized Tariff Schedule (HTS) Code: 8542.31.00.25; Introduction Date: 2019-03-07; Length: 7mm; Lifecycle Status: Production; Max Operating Temperature: 85°C; Memory Size: 128kB; Memory Format: FLASH; Min Operating Temperature: -40°C; Number of I2C Channels: 2; Number of SPI Channels: 2; Number of Terminals: 48; Number of USB Channels: 2; REACH SVHC: Yes; Schedule B: 8542310000, 8542310000|8542310000, 8542310000|8542310000|8542310000|8542310000|8542310000; Terminal Pitch: 500µm; Width: 7mm; ComponentLink1URL: https://datasheet.octopart.com:443/STM32G071CBT6-STMicroelectronics-datasheet-159144893.pdf?src-supplier=IHS; ComponentLink1Description: https://datasheet.octopart.com:443/STM32G071CBT6-STMicroelectronics-datasheet-159144893.pdf?src-supplier=IHS; ComponentLink2URL: https://datasheet.octopart.com:443/STM32G071CBT6-STMicroelectronics-datasheet-132344621.pdf?src-supplier=ODG+(Origin+Data+Global); ComponentLink2Description: https://datasheet.octopart.com:443/STM32G071CBT6-STMicroelectronics-datasheet-132344621.pdf?src-supplier=ODG+(Origin+Data+Global); ComponentLink3URL: https://datasheet.octopart.com:443/STM32G071CBT6-STMicroelectronics-datasheet-130125765.pdf?src-supplier=element14+APAC; ComponentLink3Description: https://datasheet.octopart.com:443/STM32G071CBT6-STMicroelectronics-datasheet-130125765.pdf?src-supplier=element14+APAC
U2 = LM2936MP-5.0: 50-mA, 60-V, low-IQ, low-dropout voltage regulator with reverse voltage protection 4-SOT-223 -40 to 125; MF: Texas Instruments; SnapEDA_Link: https://www.snapeda.com/parts/LM2936MP-5.0/Texas+Instruments/view-part/?ref=snap; Package: SOT-223-4 Texas Instruments; Value: *; MP: LM2936MP-5.0; Check_prices: https://www.snapeda.com/parts/LM2936MP-5.0/Texas+Instruments/view-part/?ref=eda

## Nets that join several sheets
3.3V: Microcontroller (16 pins), Power (8 pins)
BAT: Connectors_U_B (J3.1 Tp7.1), Microcontroller (R40.2), Power (C1.2 C8.1 R18.1 R21.2)
GND: Connectors_U_B (28 pins), Microcontroller (25 pins), Power (53 pins)
VBUS: Connectors_U_B (F1.1 Tp4.1), Power (13 pins)
12C1_SCL: Microcontroller (R52.1 Tp37.1 U3.45), Power (U1.13)
12C1_SDA: Microcontroller (R54.1 Tp36.1 U3.46), Power (U1.12)
~{PROCHOT}: Microcontroller (U3.20), Power (R32.1 U1.11)
CELL_1S: Connectors_U_B (7 pins), Microcontroller (R39.2)
CELL_1S_DIS_EN: Connectors_U_B (R16.2 T4.2), Microcontroller (U3.43)
CELL_2S: Connectors_U_B (7 pins), Microcontroller (R37.2)
CELL_2S_DIS_EN: Connectors_U_B (R12.2 T3.2), Microcontroller (U3.44)
CELL_3S: Connectors_U_B (6 pins), Microcontroller (R38.2)
CELL_3S_DIS_EN: Connectors_U_B (R9.2 T2.2), Microcontroller (U3.47)
CELL_4S: Connectors_U_B (J5.1 Q1.3 R1.2 Tp9.1), Microcontroller (R36.2)
CELL_4S_DIS_EN: Connectors_U_B (R3.2 T1.2), Microcontroller (U3.48)
CHRG_OK: Microcontroller (U3.24), Power (R35.1 Tp18.1 U1.4)
EN_OTG: Microcontroller (U3.19), Power (R34.1 U1.5)
ILIM_HIZ: Microcontroller (U3.23), Power (R29.2 Tp14.1 U1.6)
UCPD2_CC1: Connectors_U_B (R2.1), Microcontroller (R47.2 U3.38)
UCPD2_CC2: Connectors_U_B (R4.1), Microcontroller (R49.2 U3.40)